# Altium project sensorboard.PrjPCB
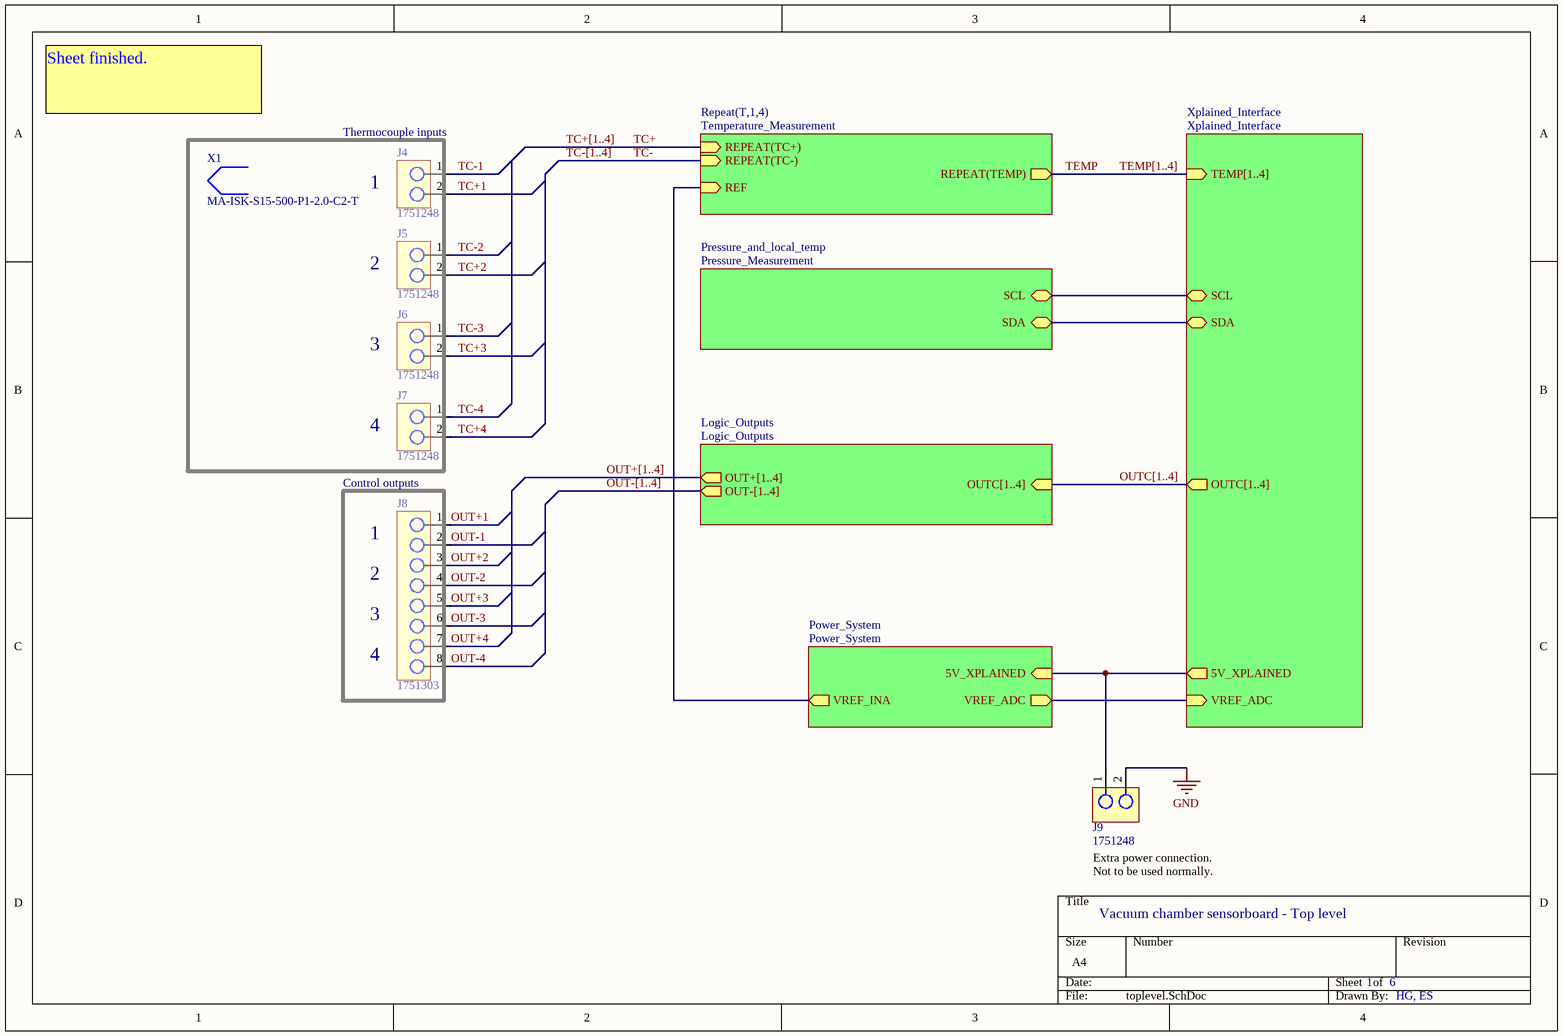
[diagram p0: toplevel.SchDoc]
ProjectTitle: Vacuum chamber sensorboard; Initials: HG, ES
6 sheets, 167 parts. Net scope: hierarchical (ports join the sheet entries above them; power ports are global).
Board file: Sensorboard.PcbDoc
Sheets:
  toplevel.SchDoc
    Xplained_Interface = Xplained_Interface.SchDoc
    Pressure_and_local_temp = Pressure_Measurement.SchDoc
    T1 = Temperature_Measurement.SchDoc
    T2 = Temperature_Measurement.SchDoc
    T3 = Temperature_Measurement.SchDoc
    T4 = Temperature_Measurement.SchDoc
    Logic_Outputs = Logic_Outputs.SchDoc
    Power_System = Power_System.SchDoc

## Sheet toplevel.SchDoc: Vacuum chamber sensorboard - Top level
size A4; SheetNumber: 1; SheetTotal: 6; PageSetup: Record=PageOptions|CenterHorizontal=True|CenterVertical=True|PrintScale=2.81|XCorrection=1.00|YCorrection=1.00|PrintKind=0|BorderSize=5000000|LeftOffset=0|BottomOffset=0|Orientation=2|PaperLength=1000|PaperWidth=1000|Scale=100|PaperSource=7|PrintQuality=-4|MediaType=1|DitherType=10|PaperKind=A1 (594 x 841mm)|PrintScaleMode=1

### Parts
J4  1751248  [Terminalblock Pheonix 2P]
J5  1751248  [Terminalblock Pheonix 2P]
J6  1751248  [Terminalblock Pheonix 2P]
J7  1751248  [Terminalblock Pheonix 2P]
J8  1751303  [TERMINALBLOCK pheonix 8p]
J9  1751248  [Terminalblock Pheonix 2P]
X1  MA-ISK-S15-500-P1-2.0-C2-T  (mechanical)

### Sub-sheets
Logic_Outputs = Logic_Outputs: OUT+[1..4] (out), OUTC[1..4] (in), OUT-[1..4] (out)
Power_System = Power_System: 5V_XPLAINED (in), VREF_ADC (out), VREF_INA (out)
Pressure_and_local_temp = Pressure_Measurement: SDA (bidir), SCL (bidir)
Repeat(T,1,4) = Temperature_Measurement: REPEAT(TC-) (in), REPEAT(TC+) (in), REPEAT(TEMP) (out), REF (in)
Xplained_Interface = Xplained_Interface: OUTC[1..4] (out), VREF_ADC (in), 5V_XPLAINED (out), SCL (bidir), SDA (bidir), TEMP[1..4] (in)

### Nets
GND: J9.2
OUT+1: J8.1
OUT+2: J8.3
OUT+3: J8.5
OUT+4: J8.7
OUT-1: J8.2
OUT-2: J8.4
OUT-3: J8.6
OUT-4: J8.8
SCL: sheet Xplained_Interface/SCL, sheet Pressure_and_local_temp/SCL
SDA: sheet Xplained_Interface/SDA, sheet Pressure_and_local_temp/SDA
TC+: sheet Repeat(T,1,4)/REPEAT(TC+)
TC+1: J4.2
TC+2: J5.2
TC+3: J6.2
TC+4: J7.2
TC-: sheet Repeat(T,1,4)/REPEAT(TC-)
TC-1: J4.1
TC-2: J5.1
TC-3: J6.1
TC-4: J7.1
TEMP: sheet Repeat(T,1,4)/REPEAT(TEMP)
NetC22_2: sheet Xplained_Interface/VREF_ADC, sheet Power_System/VREF_ADC
NetJ3_10: J9.1 ; sheet Xplained_Interface/5V_XPLAINED, sheet Power_System/5V_XPLAINED
NetTP9_0: sheet Repeat(T,1,4)/REF, sheet Power_System/VREF_INA

### Buses and harness runs
bus OUT+[1..4] = sheet Logic_Outputs/OUT+[1..4]
bus OUT-[1..4] = sheet Logic_Outputs/OUT-[1..4]
bus OUTC[1..4] = sheet Logic_Outputs/OUTC[1..4] = sheet Xplained_Interface/OUTC[1..4]
bus TC+[1..4]
bus TC-[1..4]
bus TEMP[1..4] = sheet Xplained_Interface/TEMP[1..4]

### Notes on the sheet
- Sheet finished.
- (near J4) Thermocouple inputs
- (near J4) 1
- (near J5) 2
- (near J6) 3
- (near J7) 4
- Control outputs
- (near J8) 1
- (near J8) 2
- (near J8) 3
- (near J8) 4
- Extra power connection.
  Not to be used normally.

### Library data of the parts
J4-J7 J9 = 1751248: Terminal block, 2P, 3.5mm, screw; Manufacturer: Phoenix Contact; ComponentLink1Description: Datasheet; ComponentLink1URL: https://www.phoenixcontact.com/online/portal/us?uri=pxc-oc-itemdetail:pid=1751248&library=usen&pcck=P-11-01-01&tab=1; PackageReference: SIP; Supplier 1: Mouser; Supplier Part Number 1: 651-1751248
J8 = 1751303: Terminal block, 8P, 3.5mm, screw; Manufacturer: Phoenix Contact; ComponentLink1Description: Datasheet; ComponentLink1URL: https://www.phoenixcontact.com/online/portal/us?uri=pxc-oc-itemdetail:pid=1751303&library=usen&pcck=P-11-01-01&tab=1; PackageReference: SIP; Supplier 1: Mouser; Supplier Part Number 1: 651-1751303
X1 = MA-ISK-S15-500-P1-2.0-C2-T: Type K thermocouple, mineral insulated; Manufacturer: Labfacility; PackageReference: http://www.farnell.com/datasheets/49105.pdf; ComponentLink1Description: Datasheet; ComponentLink1URL: http://www.ti.com/lit/ds/slvs720d/slvs720d.pdf; Supplier 1: Farnell; Supplier Part Number 1: 1289623

## Sheet Xplained_Interface.SchDoc: Vacuum chamber sensorboard - Xplained interface
size A4; SheetNumber: 6; SheetTotal: 6; PageSetup: Record=PageOptions|CenterHorizontal=True|CenterVertical=True|PrintScale=0.97|XCorrection=1.00|YCorrection=1.00|PrintKind=0|BorderSize=5000000|LeftOffset=0|BottomOffset=0|Orientation=2|PaperLength=1000|PaperWidth=1000|Scale=100|PaperSource=7|PrintQuality=-4|MediaType=1|DitherType=10|PaperKind=A4|PrintScaleMode=1
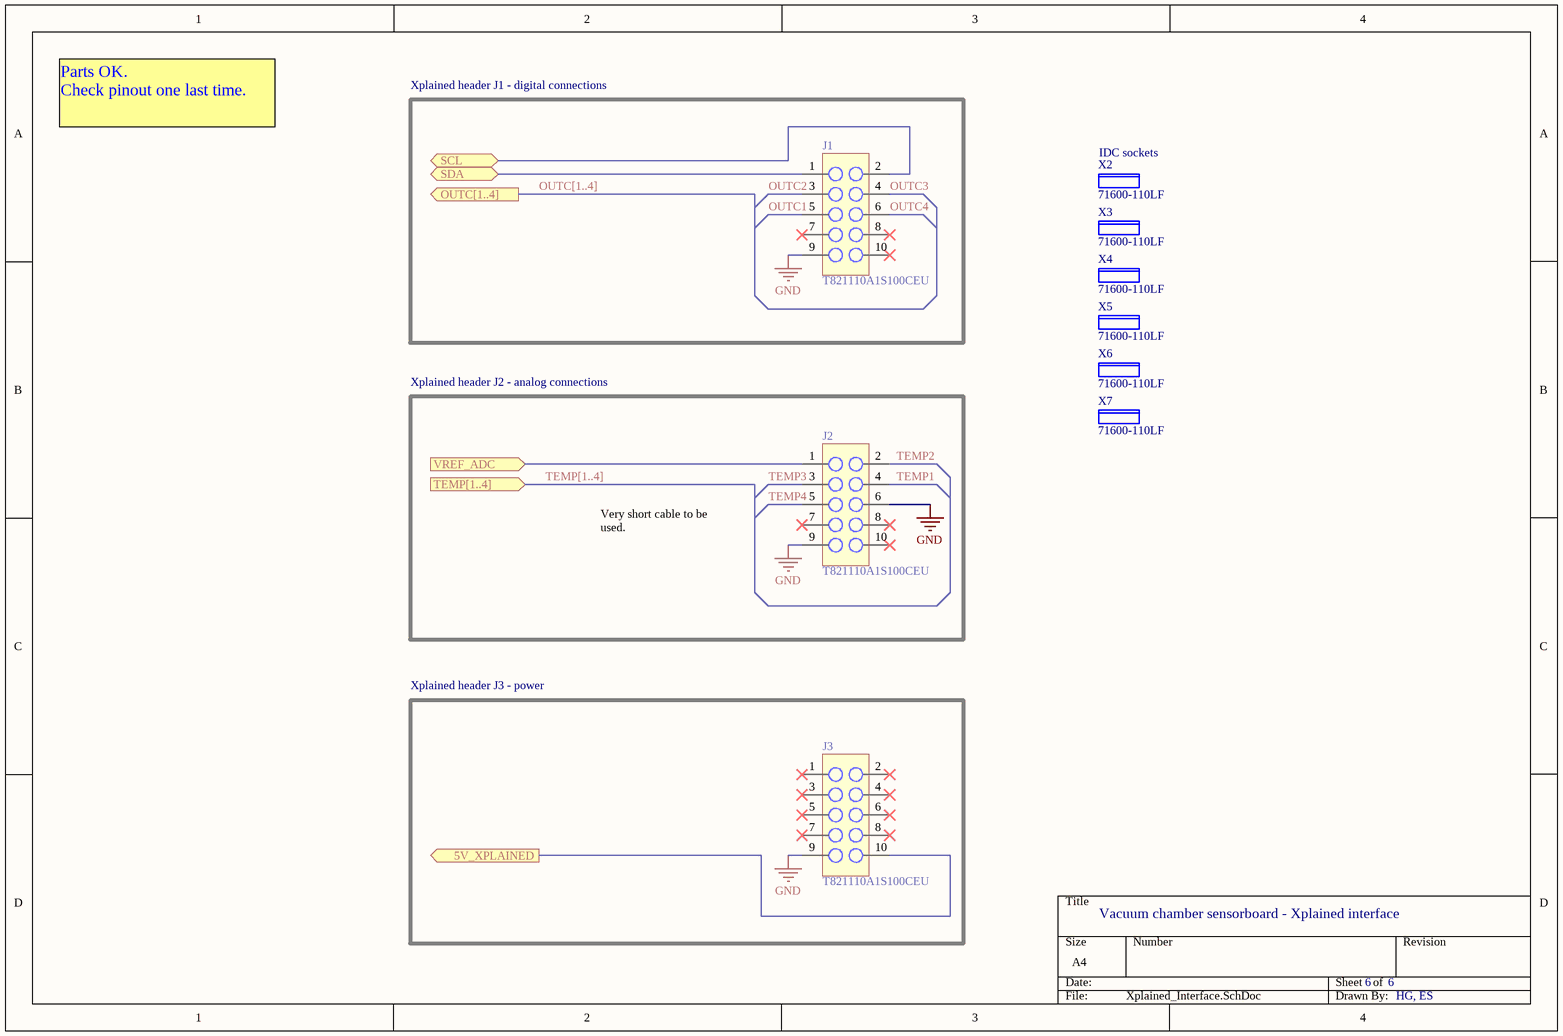
[diagram p1: Xplained_Interface.SchDoc]

### Parts
J1  T821110A1S100CEU  [Header 10P]
J2  T821110A1S100CEU  [Header 10P]
J3  T821110A1S100CEU  [Header 10P]
X2  71600-110LF  (mechanical)
X3  71600-110LF  (mechanical)
X4  71600-110LF  (mechanical)
X5  71600-110LF  (mechanical)
X6  71600-110LF  (mechanical)
X7  71600-110LF  (mechanical)

### Blocks framed on the sheet
Xplained header J1 - digital connections: J1
Xplained header J2 - analog connections: J2
Xplained header J3 - power: J3

### Ports
5V_XPLAINED (out), OUTC[1..4] (out), SCL (bidir), SDA (bidir), TEMP[1..4] (in), VREF_ADC (in)

### Nets
GND: J1.9 J2.6 J2.9 J3.9
OUTC1: J1.5
OUTC2: J1.3
OUTC3: J1.4
OUTC4: J1.6
SCL: J1.2 ; port SCL
SDA: J1.1 ; port SDA
TEMP1: J2.4
TEMP2: J2.2
TEMP3: J2.3
TEMP4: J2.5
NetC22_2: J2.1 ; port VREF_ADC
NetJ3_10: J3.10 ; port 5V_XPLAINED

Not connected (* = marked no-connect by the designer): J1 7* 8* 10*; J2 7* 8* 10*; J3 1* 2* 3* 4* 5* 6* 7* 8*

### Buses and harness runs
bus OUTC[1..4] = port OUTC[1..4]
bus TEMP[1..4] = port TEMP[1..4]

### Notes on the sheet
- Parts OK.
  Check pinout one last time.
- (near X2) IDC sockets
- Very short cable to be used.

### Library data of the parts
J1-J3 = T821110A1S100CEU: Header, 2x5, 2.54mm; Manufacturer: Amphenol; ComponentLink1Description: Datasheet; ComponentLink1URL: http://www.farnell.com/datasheets/1648843.pdf; PackageReference: DIP-10; Supplier 1: Farnell; Supplier Part Number 1: 2215304
X2-X7 = 71600-110LF: IDC socket, 10way, 2.54 mm; Manufacturer: FCI; ComponentLink1Description: Datasheet; ComponentLink1URL: http://www.farnell.com/datasheets/3453.pdf; Supplier 1: Farnell; Supplier Part Number 1: 1103927

## Sheet Pressure_Measurement.SchDoc: Vacuum chamber sensorboard - Pressure and local temperature
size A4; SheetNumber: 3; SheetTotal: 6
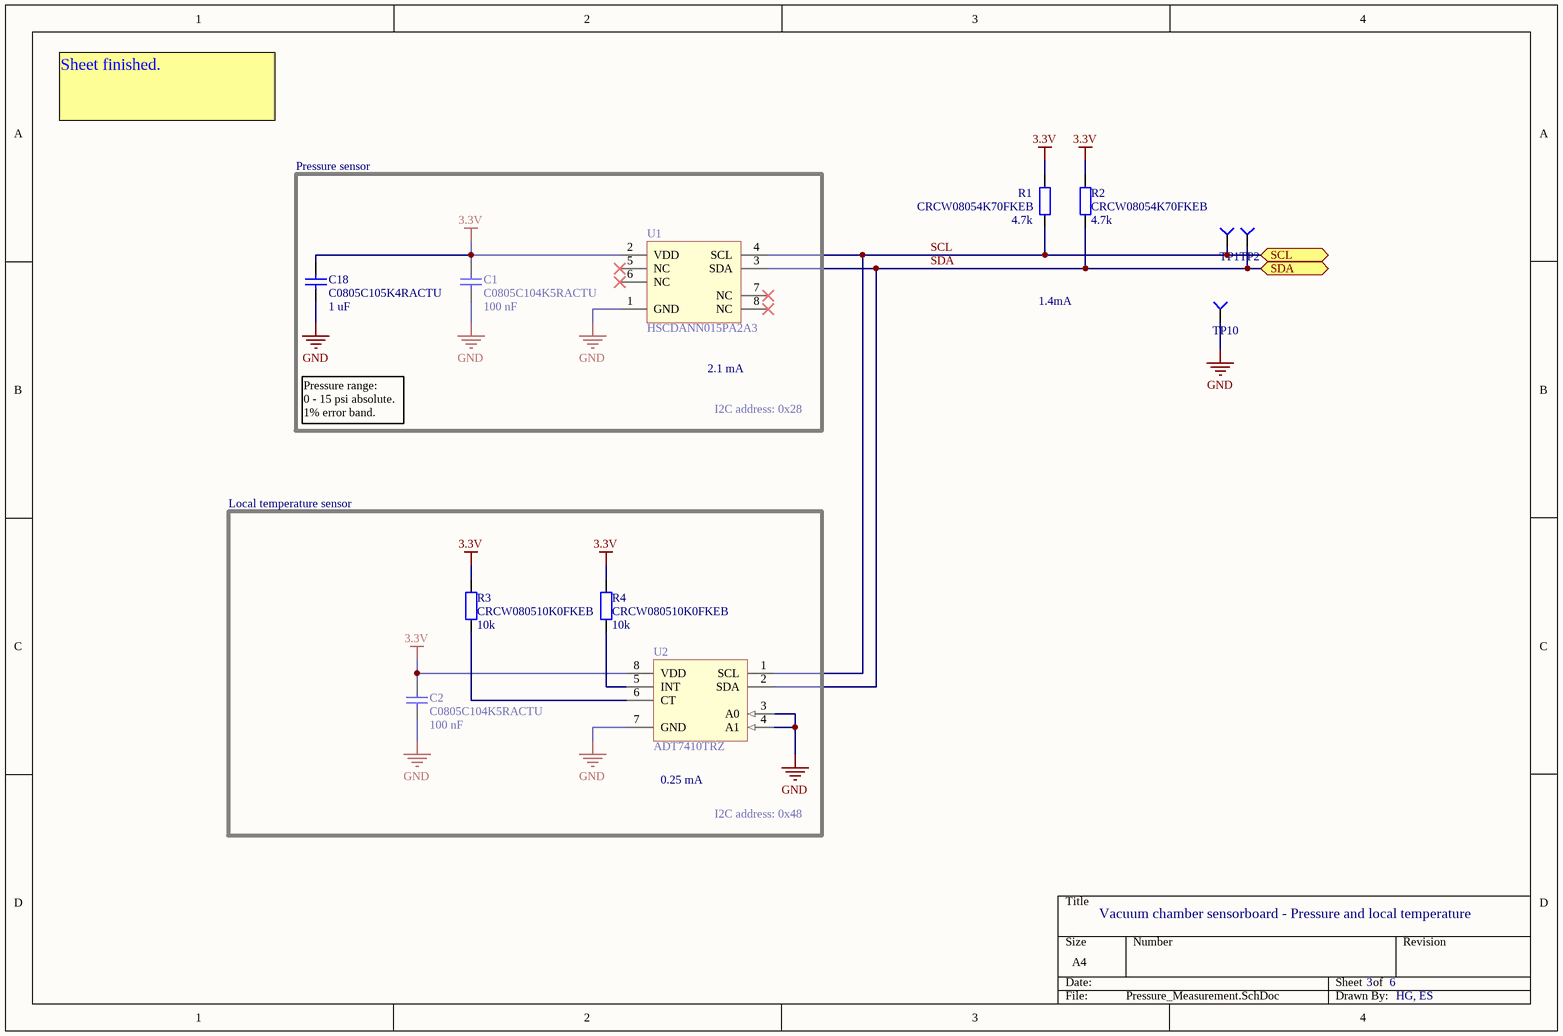
[diagram p2: Pressure_Measurement.SchDoc]

### Parts
C1  C0805C104K5RACTU  value 100 nF  [Cap Kemet 0805]
C2  C0805C104K5RACTU  value 100 nF  [Cap Kemet 0805]
C18  C0805C105K4RACTU  value 1 uF  [Cap Kemet 0805]
R1  CRCW08054K70FKEB  value 4.7k  [Res Vishay0805]
R2  CRCW08054K70FKEB  value 4.7k  [Res Vishay0805]
R3  CRCW080510K0FKEB  value 10k  [Res Vishay0805]
R4  CRCW080510K0FKEB  value 10k  [Res Vishay0805]
TP1  Test_point  [Testpoint]  (value not drawn)
TP2  Test_point  [Testpoint]  (value not drawn)
TP10  Test_point  [Testpoint]  (value not drawn)
U1  HSCDANN015PA2A3  [HSCDANN015PA2A3 Pressure sensor]
U2  ADT7410TRZ  [ADT7410]

### Ports
SCL (bidir), SDA (bidir)

### Nets
3.3V: C1.2 C2.2 C18.2 R1.2 R2.2 R3.2 R4.2 U1.2(VDD) U2.8(VDD)
GND: C1.1 C2.1 C18.1 TP10.0 U1.1(GND) U2.3(A0) U2.4(A1) U2.7(GND)
SCL: R1.1 TP1.0 U1.4(SCL) U2.1(SCL) ; port SCL
SDA: R2.1 TP2.0 U1.3(SDA) U2.2(SDA) ; port SDA
NetR3_1: R3.1 U2.6(CT)
NetR4_1: R4.1 U2.5(INT)

Not connected (* = marked no-connect by the designer): U1 5(NC)* 6(NC)* 7(NC)* 8(NC)*

### Notes on the sheet
- Sheet finished.
- Pressure sensor
- 1.4mA
- 2.1 mA
- Pressure range:
  0 - 15 psi absolute.
  1% error band.
- I2C address: 0x28
- Local temperature sensor
- (near U2) 0.25 mA
- I2C address: 0x48

### Library data of the parts
C1 C2 = C0805C104K5RACTU: Ceramic capacitor, X7R, 10%, 50V; Manufacturer: Kemet; ComponentLink1Description: Datasheet; ComponentLink1URL: http://www.kemet.com/kemet/web/homepage/kechome.nsf/vapubfiles/KEM_C1002_X7R_SMD.pdf/$file/KEM_C1002_X7R_SMD.pdf; PackageReference: 0805; Supplier 1: Mouser; Supplier Part Number 1: 80-C0805C104K5R; Supplier 2: Farnell; Supplier Part Number 2: 1414664
C18 = C0805C105K4RACTU: Ceramic capacitor, X7R, 10%, 16V; Manufacturer: Kemet; ComponentLink1Description: Datasheet; ComponentLink1URL: http://www.kemet.com/kemet/web/homepage/kechome.nsf/vapubfiles/KEM_C1002_X7R_SMD.pdf/$file/KEM_C1002_X7R_SMD.pdf; PackageReference: 0805; Supplier 1: Mouser; Supplier Part Number 1: 80-C0805C105K4R; Supplier 2: Farnell; Supplier Part Number 2: 9227792
R1 R2 = CRCW08054K70FKEB: Thick film resistor, 1%, 125mW; Manufacturer: Vishay; ComponentLink1Description: Datasheet; ComponentLink1URL: http://www.vishay.com/docs/20035/dcrcwe3.pdf; PackageReference: 0805; Supplier 1: Mouser; Supplier Part Number 1: 71-CRCW08054K70FKEB
R3 R4 = CRCW080510K0FKEB: Thick film resistor, 1%, 125mW; Manufacturer: Vishay; ComponentLink1Description: Datasheet; ComponentLink1URL: http://www.vishay.com/docs/20035/dcrcwe3.pdf; PackageReference: 0805; Supplier 1: Mouser; Supplier Part Number 1: 71-CRCW080510K0FKEB
TP1 TP2 TP10 = Test_point: pin to pad: 0>1; ComponentLink1Description: Datasheet
U1 = HSCDANN015PA2A3: Absolute pressure sensor, I2C output; PackageReference: DIP-8; ComponentLink1Description: Datasheet; ComponentLink1URL: http://sensing.honeywell.com/honeywell-sensing-hsc-high-accuracy-silicon-pressure-sensors-digital-product-sheet-008214-2-en.pdf?name=HSCMAND015PASA5; Supplier 1: Mouser; Supplier Part Number 1: 785-HSCDANN015PA2A3
U2 = ADT7410TRZ: Temperature sensor, I2C output; PackageReference: SOIC-8; ComponentLink1Description: Datasheet; ComponentLink1URL: http://www.analog.com/static/imported-files/data_sheets/ADT7410.pdf; Supplier 1: Mouser; Supplier Part Number 1: 584-ADT7410TRZ; Supplier 2: Farnell; Supplier Part Number 2: 2102534

## Sheet Temperature_Measurement.SchDoc: Vacuum chamber sensorboard - Thermocouple interface
size A4; SheetNumber: 2; SheetTotal: 6
Used 4 times, as channels T1, T2, T3, T4. Parts and nets are listed once, with the designators drawn on the sheet.
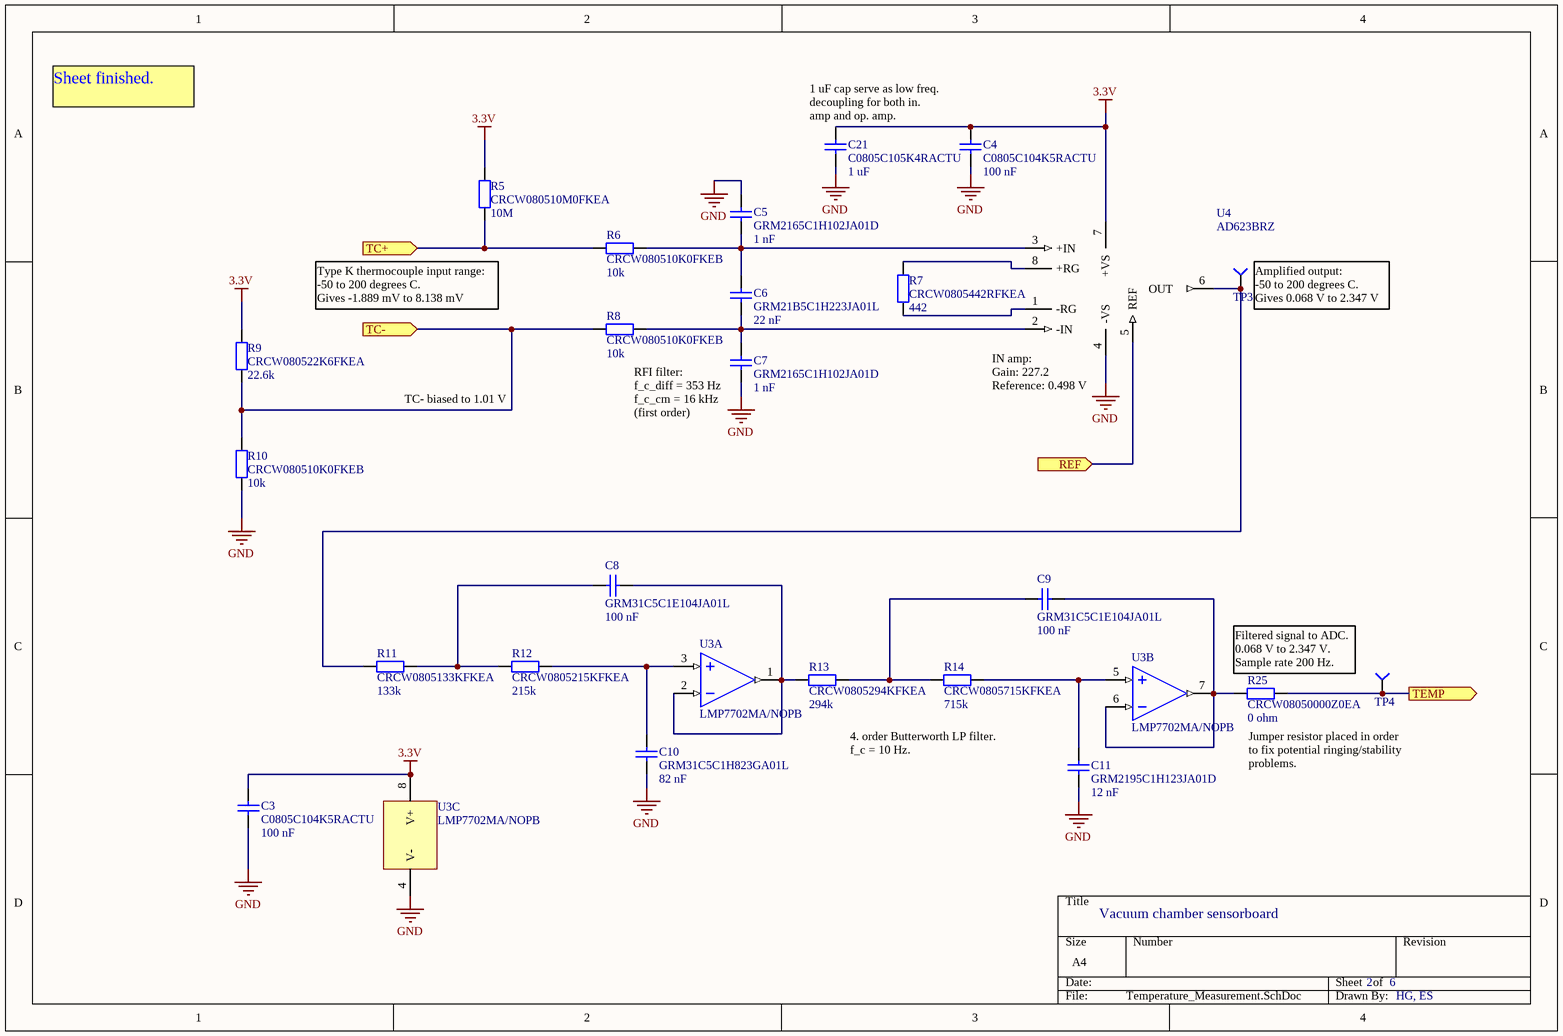
[diagram p3: Temperature_Measurement.SchDoc]

### Parts
C3  C0805C104K5RACTU  value 100 nF  [Cap Kemet 0805]
C4  C0805C104K5RACTU  value 100 nF  [Cap Kemet 0805]
C5  GRM2165C1H102JA01D  value 1 nF  [CAP0805 murata]
C6  GRM21B5C1H223JA01L  value 22 nF  [CAP0805 murata]
C7  GRM2165C1H102JA01D  value 1 nF  [CAP0805 murata]
C8  GRM31C5C1E104JA01L  value 100 nF  [Cap1206 Murata]
C9  GRM31C5C1E104JA01L  value 100 nF  [Cap1206 Murata]
C10  GRM31C5C1H823GA01L  value 82 nF  [Cap1206 Murata]
C11  GRM2195C1H123JA01D  value 12 nF  [CAP0805 murata]
C21  C0805C105K4RACTU  value 1 uF  [Cap Kemet 0805]
R5  CRCW080510M0FKEA  value 10M  [Res Vishay0805]
R6  CRCW080510K0FKEB  value 10k  [Res Vishay0805]
R7  CRCW0805442RFKEA  value 442  [Res Vishay0805]
R8  CRCW080510K0FKEB  value 10k  [Res Vishay0805]
R9  CRCW080522K6FKEA  value 22.6k  [Res Vishay0805]
R10  CRCW080510K0FKEB  value 10k  [Res Vishay0805]
R11  CRCW0805133KFKEA  value 133k  [Res Vishay0805]
R12  CRCW0805215KFKEA  value 215k  [Res Vishay0805]
R13  CRCW0805294KFKEA  value 294k  [Res Vishay0805]
R14  CRCW0805715KFKEA  value 715k  [Res Vishay0805]
R25  CRCW08050000Z0EA  value 0 ohm  [Res Vishay0805]
TP3  Test_point  [Testpoint]  (value not drawn)
TP4  Test_point  [Testpoint]  (value not drawn)
U3  LMP7702MA/NOPB  [OPA2333AIDR]  (parts A,B,C of 3)
U4  AD623BRZ  [AD623]

### Ports
REF (in), TC+ (in), TC- (in), TEMP (out)

### Nets
3.3V: C3.2 C4.2 C21.2 R5.2 R9.2 U3.8(V+) U4.7(+VS)
GND: C3.1 C4.1 C5.2 C7.1 C10.1 C11.1 C21.1 R10.1 U3.4(V-) U4.4(-VS)
REF: U4.5(REF) ; port REF
TC+: R5.1 R6.1 ; port TC+
TC-: R8.1 R9.1 R10.2 ; port TC-
TEMP: R25.2 TP4.0 ; port TEMP
NetC5_1: C5.1 C6.2 R6.2 U4.3(+IN)
NetC6_1: C6.1 C7.2 R8.2 U4.2(-IN)
NetC8_1: C8.1 R13.1 U3.1(OUT_A) U3.2(-IN_A)
NetC8_2: C8.2 R11.2 R12.1
NetC9_1: C9.1 R25.1 U3.6(-IN_B) U3.7(OUT_B)
NetC9_2: C9.2 R13.2 R14.1
NetC10_2: C10.2 R12.2 U3.3(+IN_A)
NetC11_2: C11.2 R14.2 U3.5(+IN_B)
NetR7_1: R7.1 U4.1(-RG)
NetR7_2: R7.2 U4.8(+RG)
NetR11_1: R11.1 TP3.0 U4.6(OUT)

### Channels
T1: designators end in _T1; ports REF=NetTP9_0 TC+=TC+1 TC-=TC-1 TEMP=TEMP1
T2: designators end in _T2; ports REF=NetTP9_0 TC+=TC+2 TC-=TC-2 TEMP=TEMP2
T3: designators end in _T3; ports REF=NetTP9_0 TC+=TC+3 TC-=TC-3 TEMP=TEMP3
T4: designators end in _T4; ports REF=NetTP9_0 TC+=TC+4 TC-=TC-4 TEMP=TEMP4

### Notes on the sheet
- Sheet finished.
- (near C21) 1 uF cap serve as low freq. decoupling for both in. amp and op. amp.
- Type K thermocouple input range:
  -50 to 200 degrees C.
  Gives -1.889 mV to 8.138 mV
- (near TP3) Amplified output:
  -50 to 200 degrees C.
  Gives 0.068 V to 2.347 V
- TC- biased to 1.01 V
- (near C7) RFI filter:
  f_c_diff = 353 Hz
  f_c_cm = 16 kHz
  (first order)
- (near U4) IN amp:
  Gain: 227.2
  Reference: 0.498 V
- Filtered signal to ADC.
  0.068 V to 2.347 V.
  Sample rate 200 Hz.
- 4. order Butterworth LP filter.
  f_c = 10 Hz.
- Jumper resistor placed in order to fix potential ringing/stability problems.

### Library data of the parts
C3 C4 = C0805C104K5RACTU: as C1 on sheet Pressure_Measurement; ComponentLink1Description: Datasheet; ComponentLink1URL: http://www.kemet.com/kemet/web/homepage/kechome.nsf/vapubfiles/KEM_C1002_X7R_SMD.pdf/$file/KEM_C1002_X7R_SMD.pdf; PackageReference: 0805; Supplier 1: Mouser; Supplier Part Number 1: 80-C0805C104K5R; Supplier 2: Farnell; Supplier Part Number 2: 1414664
C5 C7 = GRM2165C1H102JA01D: Ceramic capacitor, C0G, 5%, 50V; Manufacturer: Murata; ComponentLink1Description: Datasheet; ComponentLink1URL: http://psearch.murata.com/capacitor/product/GRM2165C1H102JA01%23.pdf; PackageReference: 0805; Supplier 1: Mouser; Supplier Part Number 1: 81-GRM40C102J50D
C6 = GRM21B5C1H223JA01L: Ceramic capacitor, C0G, 5%, 50V; Manufacturer: Murata; ComponentLink1Description: Datasheet; ComponentLink1URL: http://psearch.murata.com/capacitor/product/GRM21B5C1H223JA01%23.pdf; PackageReference: 0805; Supplier 1: Mouser; Supplier Part Number 1: 81-GRM215C1H223JA01L; Supplier 2: Farnell; Supplier Part Number 2: 1828943
C8 C9 = GRM31C5C1E104JA01L: Ceramic capacitor, C0G, 5%, 25V; Manufacturer: Murata; ComponentLink1Description: Datasheet; ComponentLink1URL: http://psearch.murata.com/capacitor/product/GRM31C5C1E104JA01%23.pdf; PackageReference: 1206; Supplier 1: Mouser; Supplier Part Number 1: 81-GRM31C5C1E104JA01
C10 = GRM31C5C1H823GA01L: Ceramic capacitor, C0G, 2%, 50V; Manufacturer: Murata; ComponentLink1Description: Datasheet; ComponentLink1URL: http://www.murata.com/products/catalog/pdf/c02e.pdf; PackageReference: 1206; Supplier 1: Mouser; Supplier Part Number 1: 81-GRM31C5C1H823GA1L
C11 = GRM2195C1H123JA01D: Ceramic capacitor, C0G, 5%, 50V; Manufacturer: Murata; ComponentLink1Description: Datasheet; ComponentLink1URL: http://psearch.murata.com/capacitor/product/GRM2195C1H123JA01%23.pdf; PackageReference: 0805; Supplier 1: Mouser; Supplier Part Number 1: 81-GRM2195C1H123JA1D
C21 = C0805C105K4RACTU: as C18 on sheet Pressure_Measurement; ComponentLink1Description: Datasheet; ComponentLink1URL: http://www.kemet.com/kemet/web/homepage/kechome.nsf/vapubfiles/KEM_C1002_X7R_SMD.pdf/$file/KEM_C1002_X7R_SMD.pdf; PackageReference: 0805; Supplier 1: Mouser; Supplier Part Number 1: 80-C0805C105K4R; Supplier 2: Farnell; Supplier Part Number 2: 9227792
R5 = CRCW080510M0FKEA: Thick film resistor, 1%, 125mW; Manufacturer: Vishay; ComponentLink1Description: Datasheet; ComponentLink1URL: http://www.vishay.com/docs/20035/dcrcwe3.pdf; PackageReference: 0805; Supplier 1: Mouser; Supplier Part Number 1: 71-CRCW0805-10M-E3
R6 R8 R10 = CRCW080510K0FKEB: as R3 on sheet Pressure_Measurement; ComponentLink1Description: Datasheet; ComponentLink1URL: http://www.vishay.com/docs/20035/dcrcwe3.pdf; PackageReference: 0805; Supplier 1: Mouser; Supplier Part Number 1: 71-CRCW080510K0FKEB
R7 = CRCW0805442RFKEA: Thick film resistor, 1%, 125mW; Manufacturer: Vishay; ComponentLink1Description: Datasheet; ComponentLink1URL: http://www.vishay.com/docs/20035/dcrcwe3.pdf; PackageReference: 0805; Supplier 1: Mouser; Supplier Part Number 1: 71-CRCW0805-442-E3
R9 = CRCW080522K6FKEA: Thick film resistor, 1%, 125mW; Manufacturer: Vishay; ComponentLink1Description: Datasheet; ComponentLink1URL: http://www.vishay.com/docs/20035/dcrcwe3.pdf; PackageReference: 0805; Supplier 1: Mouser; Supplier Part Number 1: 71-CRCW0805-22.6K-E3; Supplier 2: Farnell; Supplier Part Number 2: 1652961
R11 = CRCW0805133KFKEA: Thick film resistor, 1%, 125mW; Manufacturer: Vishay; ComponentLink1Description: Datasheet; ComponentLink1URL: http://www.vishay.com/docs/20035/dcrcwe3.pdf; PackageReference: 0805; Supplier 1: Mouser; Supplier Part Number 1: 71-CRCW0805-133K-E3
R12 = CRCW0805215KFKEA: Thick film resistor, 1%, 125mW; Manufacturer: Vishay; ComponentLink1Description: Datasheet; ComponentLink1URL: http://www.vishay.com/docs/20035/dcrcwe3.pdf; PackageReference: 0805; Supplier 1: Mouser; Supplier Part Number 1: 71-CRCW0805-215K-E3; Supplier 2: Farnell; Supplier Part Number 2: 1652955
R13 = CRCW0805294KFKEA: Thick film resistor, 1%, 125mW; Manufacturer: Vishay; ComponentLink1Description: Datasheet; ComponentLink1URL: http://www.vishay.com/docs/20035/dcrcwe3.pdf; PackageReference: 0805; Supplier 1: Mouser; Supplier Part Number 1: 71-CRCW0805294KFKEA
R14 = CRCW0805715KFKEA: Thick film resistor, 1%, 125mW; Manufacturer: Vishay; ComponentLink1Description: Datasheet; ComponentLink1URL: http://www.vishay.com/docs/20035/dcrcwe3.pdf; PackageReference: 0805; Supplier 1: Mouser; Supplier Part Number 1: 71-CRCW0805715KFKEA
R25 = CRCW08050000Z0EA: Thick film resistor, 1%, 125mW; Manufacturer: Vishay; ComponentLink1Description: Datasheet; ComponentLink1URL: http://www.vishay.com/docs/20035/dcrcwe3.pdf; PackageReference: 0805; Supplier 1: Mouser; Supplier Part Number 1: 71-CRCW0805-0-E3
TP3 TP4 = Test_point: pin to pad: 0>1; ComponentLink1Description: Datasheet
U3 = LMP7702MA/NOPB: Op. amp, dual, rail-to-rail, single supply; PackageReference: SOIC-8; ComponentLink1Description: Datasheet; ComponentLink1URL: http://www.ti.com/lit/ds/symlink/lmp7702.pdf; Supplier 1: Farnell; Supplier Part Number 1: 1651867
U4 = AD623BRZ: Instrumentation amplifier, rail to rail; ComponentLink1Description: Datasheet; ComponentLink1URL: http://www.analog.com/static/imported-files/data_sheets/AD623.pdf; Supplier 1: Mouser; Supplier Part Number 1: 584-AD623BRZ; PackageReference: SOIC-8; Supplier 2: Farnell; Supplier Part Number 2: 2305589

## Sheet Logic_Outputs.SchDoc: Vacuum chamber sensorboard - Control outputs
size A4; SheetNumber: 4; SheetTotal: 6
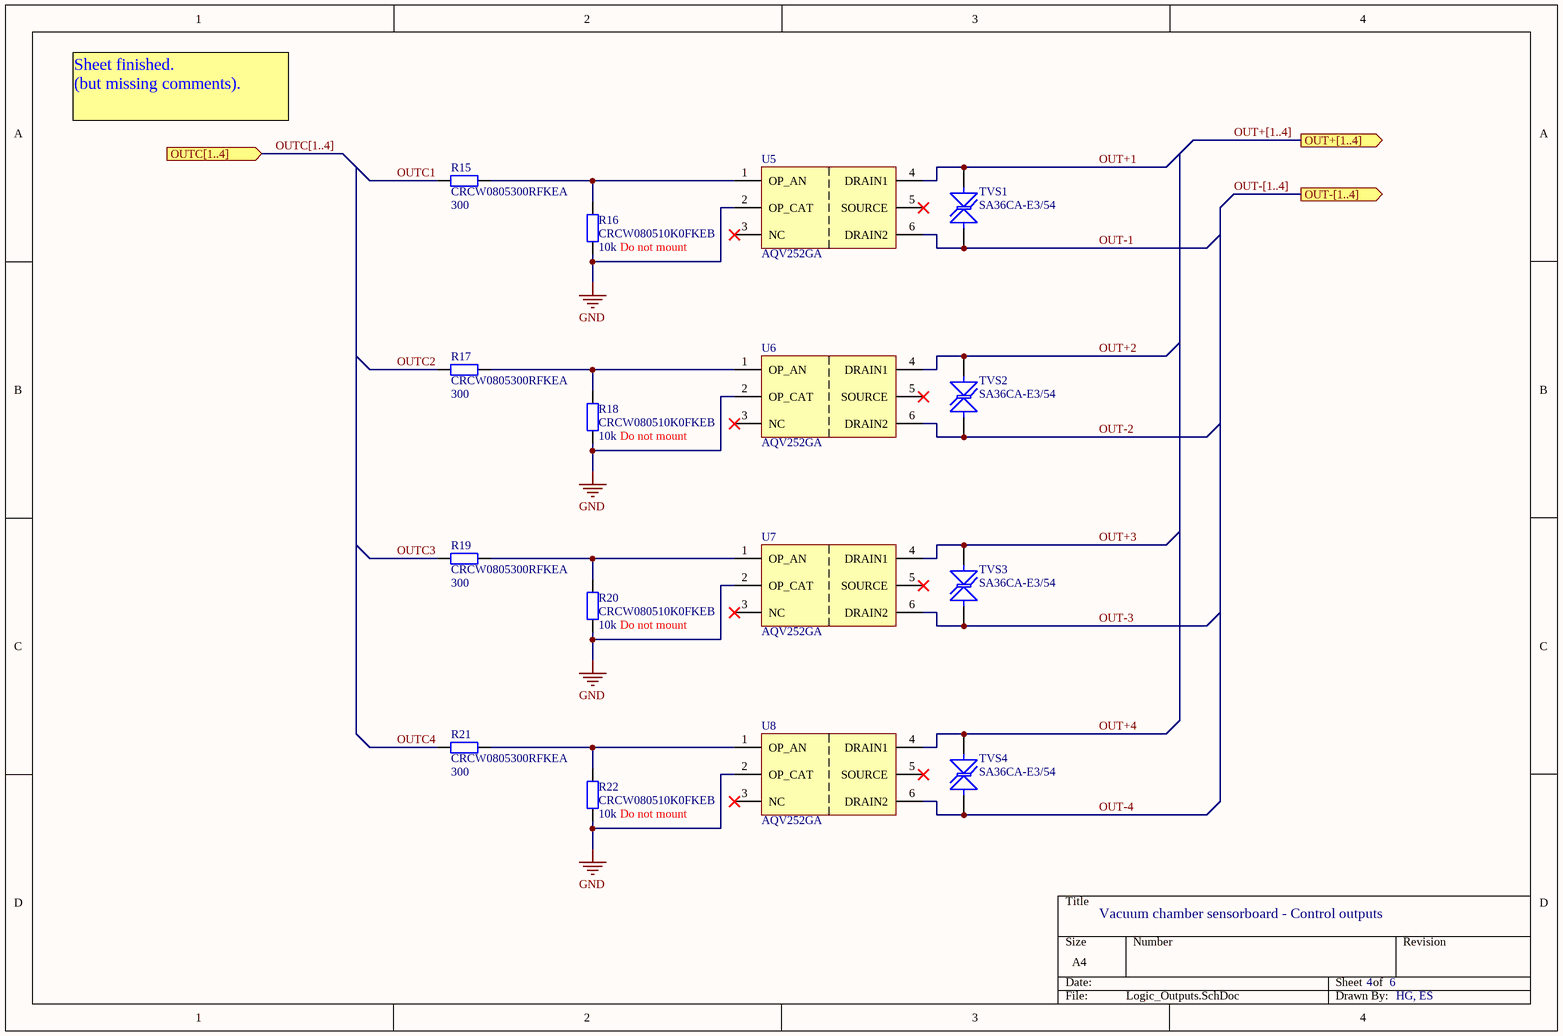
[diagram p4: Logic_Outputs.SchDoc]

### Parts
R15  CRCW0805300RFKEA  value 300  [Res Vishay0805]
R16  CRCW080510K0FKEB  value 10k  [Res Vishay0805]
R17  CRCW0805300RFKEA  value 300  [Res Vishay0805]
R18  CRCW080510K0FKEB  value 10k  [Res Vishay0805]
R19  CRCW0805300RFKEA  value 300  [Res Vishay0805]
R20  CRCW080510K0FKEB  value 10k  [Res Vishay0805]
R21  CRCW0805300RFKEA  value 300  [Res Vishay0805]
R22  CRCW080510K0FKEB  value 10k  [Res Vishay0805]
TVS1  SA36CA-E3/54  [Diode Vishay]
TVS2  SA36CA-E3/54  [Diode Vishay]
TVS3  SA36CA-E3/54  [Diode Vishay]
TVS4  SA36CA-E3/54  [Diode Vishay]
U5  AQV252GA  [AQV252GA Panasonic]
U6  AQV252GA  [AQV252GA Panasonic]
U7  AQV252GA  [AQV252GA Panasonic]
U8  AQV252GA  [AQV252GA Panasonic]

### Ports
OUT+[1..4] (out), OUT-[1..4] (out), OUTC[1..4] (in)

### Nets
GND: R16.1 R18.1 R20.1 R22.1 U5.2(OP_CAT) U6.2(OP_CAT) U7.2(OP_CAT) U8.2(OP_CAT)
OUT+1: TVS1.2(K) U5.4(DRAIN1)
OUT+2: TVS2.2(K) U6.4(DRAIN1)
OUT+3: TVS3.2(K) U7.4(DRAIN1)
OUT+4: TVS4.2(K) U8.4(DRAIN1)
OUT-1: TVS1.1(A) U5.6(DRAIN2)
OUT-2: TVS2.1(A) U6.6(DRAIN2)
OUT-3: TVS3.1(A) U7.6(DRAIN2)
OUT-4: TVS4.1(A) U8.6(DRAIN2)
OUTC1: R15.1
OUTC2: R17.1
OUTC3: R19.1
OUTC4: R21.1
NetR15_2: R15.2 R16.2 U5.1(OP_AN)
NetR17_2: R17.2 R18.2 U6.1(OP_AN)
NetR19_2: R19.2 R20.2 U7.1(OP_AN)
NetR21_2: R21.2 R22.2 U8.1(OP_AN)

Not connected (* = marked no-connect by the designer): U5 3(NC)* 5(SOURCE)*; U6 3(NC)* 5(SOURCE)*; U7 3(NC)* 5(SOURCE)*; U8 3(NC)* 5(SOURCE)*

### Buses and harness runs
bus OUT+[1..4] = port OUT+[1..4]
bus OUT-[1..4] = port OUT-[1..4]
bus OUTC[1..4] = port OUTC[1..4]

### Notes on the sheet
- Sheet finished.
  (but missing comments).
- (near R16) Do not mount
- (near R18) Do not mount
- (near R20) Do not mount
- (near R22) Do not mount

### Library data of the parts
R15 R17 R19 R21 = CRCW0805300RFKEA: Thick film resistor, 1%, 125mW; Manufacturer: Vishay; ComponentLink1Description: Datasheet; ComponentLink1URL: http://www.vishay.com/docs/20035/dcrcwe3.pdf; PackageReference: 0805; Supplier 1: Mouser; Supplier Part Number 1: 71-CRCW0805300RFKEA
R16 R18 R20 R22 = CRCW080510K0FKEB: as R3 on sheet Pressure_Measurement; ComponentLink1Description: Datasheet; ComponentLink1URL: http://www.vishay.com/docs/20035/dcrcwe3.pdf; PackageReference: 0805; Supplier 1: Mouser; Supplier Part Number 1: 71-CRCW080510K0FKEB
TVS1-TVS4 = SA36CA-E3/54: TVS diode, bidirectional, 36 V; pin to pad: 1>A 2>K; Manufacturer: Vishay; ComponentLink1Description: Datasheet; ComponentLink1URL: http://www.vishay.com/docs/88378/sa50athrusa170ca.pdf; PackageReference: DO-204AC; Supplier 1: Mouser; Supplier Part Number 1: 625-SA36CA-E3/54
U5-U8 = AQV252GA: Solid state relay, DC/AC, 60V, 2.5A; Manufacturer: Panasonic; PackageReference: SMD-6; ComponentLink1Description: Datasheet; ComponentLink1URL: http://www3.panasonic.biz/ac/e/control/relay/photomos/he/he1a_aqv25_g/index.jsp; Supplier 1: Mouser; Supplier Part Number 1: 769-AQV252GA

## Sheet Power_System.SchDoc: Vacuum chamber sensorboard - Power and reference
size A4; SheetNumber: 5; SheetTotal: 6
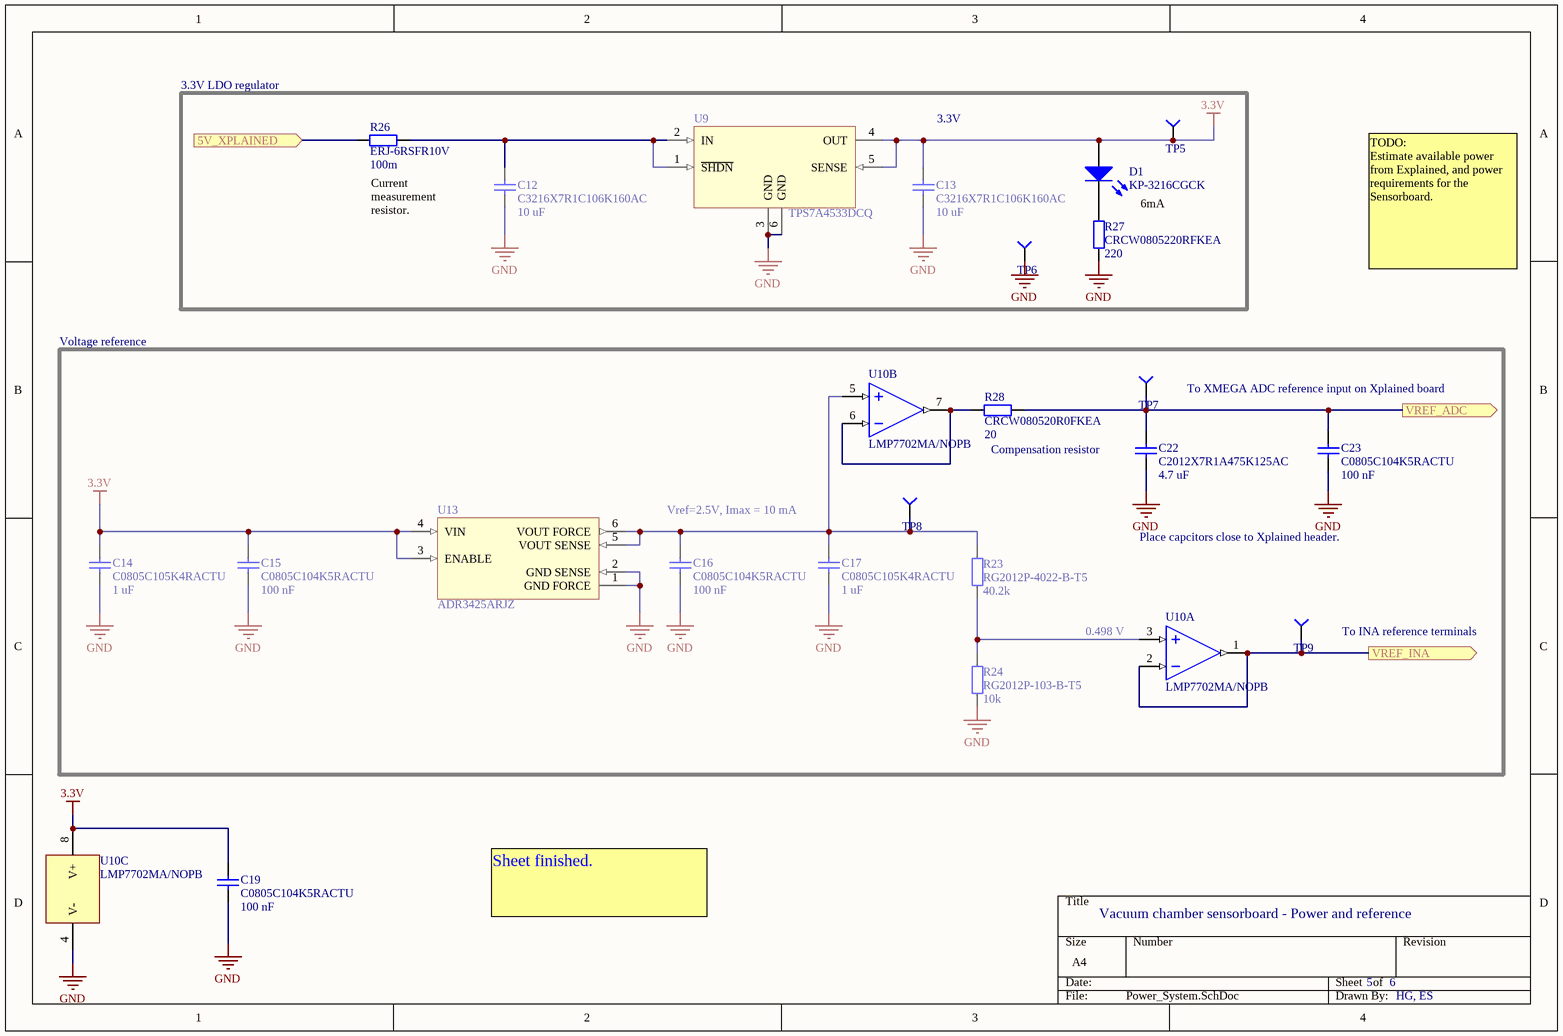
[diagram p5: Power_System.SchDoc]

### Parts
C12  C3216X7R1C106K160AC  value 10 uF  [Cap TDK1206]
C13  C3216X7R1C106K160AC  value 10 uF  [Cap TDK1206]
C14  C0805C105K4RACTU  value 1 uF  [Cap Kemet 0805]
C15  C0805C104K5RACTU  value 100 nF  [Cap Kemet 0805]
C16  C0805C104K5RACTU  value 100 nF  [Cap Kemet 0805]
C17  C0805C105K4RACTU  value 1 uF  [Cap Kemet 0805]
C19  C0805C104K5RACTU  value 100 nF  [Cap Kemet 0805]
C22  C2012X7R1A475K125AC  value 4.7 uF  [Cap TDK0805]
C23  C0805C104K5RACTU  value 100 nF  [Cap Kemet 0805]
D1  KP-3216CGCK  [Diode Kingbright]
R23  RG2012P-4022-B-T5  value 40.2k  [RES SSM 0805]
R24  RG2012P-103-B-T5  value 10k  [RES SSM 0805]
R26  ERJ-6RSFR10V  value 100m  [Res panasonic0805]
R27  CRCW0805220RFKEA  value 220  [Res Vishay0805]
R28  CRCW080520R0FKEA  value 20  [Res Vishay0805]
TP5  Test_point  [Testpoint]  (value not drawn)
TP6  Test_point  [Testpoint]  (value not drawn)
TP7  Test_point  [Testpoint]  (value not drawn)
TP8  Test_point  [Testpoint]  (value not drawn)
TP9  Test_point  [Testpoint]  (value not drawn)
U9  TPS7A4533DCQ  [TPS7A4533DCQ]
U10  LMP7702MA/NOPB  [OPA2333AIDR]  (parts A,B,C of 3)
U13  ADR3425ARJZ  [ADR3425]

### Ports
5V_XPLAINED (in), VREF_ADC (out), VREF_INA (out)

### Nets
3.3V: C13.2 C14.2 C15.2 C19.2 D1.1(A) TP5.0 U9.4(OUT) U9.5(SENSE) U10.8(V+) U13.3(ENABLE) U13.4(VIN)
GND: C12.1 C13.1 C14.1 C15.1 C16.1 C17.1 C19.1 C22.1 C23.1 R24.1 R27.1 TP6.0 U9.3(GND) U9.6(GND) U10.4(V-) U13.1(GND_FORCE) U13.2(GND_SENSE)
NetC12_2: C12.2 R26.2 U9.1(~{SHDN}) U9.2(IN)
NetC16_2: C16.2 C17.2 R23.2 TP8.0 U10.5(+IN_B) U13.5(VOUT_SENSE) U13.6(VOUT_FORCE)
NetC22_2: C22.2 C23.2 R28.2 TP7.0 ; port VREF_ADC
NetD1_2: D1.2(K) R27.2
NetJ3_10: R26.1 ; port 5V_XPLAINED
NetR23_1: R23.1 R24.2 U10.3(+IN_A)
NetR28_1: R28.1 U10.6(-IN_B) U10.7(OUT_B)
NetTP9_0: TP9.0 U10.1(OUT_A) U10.2(-IN_A) ; port VREF_INA

### Notes on the sheet
- 3.3V LDO regulator
- 3.3V
- (near R26) Current measurement resistor.
- 6mA
- TODO:
  Estimate available power from Explained, and power requirements for the Sensorboard.
- Voltage reference
- To XMEGA ADC reference input on Xplained board
- Vref=2.5V, Imax = 10 mA
- Compensation resistor
- Place capcitors close to Xplained header.
- (near U10) 0.498 V
- (near TP9) To INA reference terminals
- Sheet finished.

### Library data of the parts
C12 C13 = C3216X7R1C106K160AC: Ceramic capacitor, X7R, 10%, 16V; Manufacturer: TDK; ComponentLink1Description: Datasheet; ComponentLink1URL: http://www.mouser.com/ds/2/400/C3216X7R1C106K160AC-265314.pdf; PackageReference: 1206; Supplier 1: Mouser; Supplier Part Number 1: 810-C3216X7R1C106K; Supplier 2: Farnell; Supplier Part Number 2: 1907353
C14 C17 = C0805C105K4RACTU: as C18 on sheet Pressure_Measurement; ComponentLink1Description: Datasheet; ComponentLink1URL: http://www.kemet.com/kemet/web/homepage/kechome.nsf/vapubfiles/KEM_C1002_X7R_SMD.pdf/$file/KEM_C1002_X7R_SMD.pdf; PackageReference: 0805; Supplier 1: Mouser; Supplier Part Number 1: 80-C0805C105K4R; Supplier 2: Farnell; Supplier Part Number 2: 9227792
C15 C16 C19 C23 = C0805C104K5RACTU: as C1 on sheet Pressure_Measurement; ComponentLink1Description: Datasheet; ComponentLink1URL: http://www.kemet.com/kemet/web/homepage/kechome.nsf/vapubfiles/KEM_C1002_X7R_SMD.pdf/$file/KEM_C1002_X7R_SMD.pdf; PackageReference: 0805; Supplier 1: Mouser; Supplier Part Number 1: 80-C0805C104K5R; Supplier 2: Farnell; Supplier Part Number 2: 1414664
C22 = C2012X7R1A475K125AC: Ceramic capacitor, X7R, 10%, 10V; Manufacturer: TDK; ComponentLink1Description: Datasheet; ComponentLink1URL: http://product.tdk.com/capacitor/mlcc/en/documents/C2012X7R1A475K125AC.pdf; PackageReference: 0805; Supplier 1: Mouser; Supplier Part Number 1: 810-C2012X7R1A475K
D1 = KP-3216CGCK: Chip led lamp,green, 50mcd @ 20mA; pin to pad: 1>A 2>K; Manufacturer: Kingbright; ComponentLink1Description: Datasheet; ComponentLink1URL: http://www.farnell.com/datasheets/1683499.pdf; PackageReference: 3.2x1.6mm; Supplier 1: Farnell; Supplier Part Number 1: 2290333
R23 = RG2012P-4022-B-T5: Thin film resistor, 0.1%, 100mW; Manufacturer: Susumu; ComponentLink1Description: Datasheet; ComponentLink1URL: http://susumu-usa.com/pdf/RG_RM_RGH_DATASHEET.pdf; PackageReference: 0805; Supplier 1: Mouser; Supplier Part Number 1: 754-RG2012P-4022-BT5
R24 = RG2012P-103-B-T5: Thin film resistor, 0.1%, 100mW; Manufacturer: Susumu; ComponentLink1Description: Datasheet; ComponentLink1URL: http://susumu-usa.com/pdf/RG_RM_RGH_DATASHEET.pdf; PackageReference: 0805; Supplier 1: Mouser; Supplier Part Number 1: 754-RG2012P-103-B-T5
R26 = ERJ-6RSFR10V: Thick film resistor, 1%, 125mW; Manufacturer: Panasonic; ComponentLink1Description: Datasheet; ComponentLink1URL: http://industrial.panasonic.com/www-data/pdf/AOA0000/AOA0000CE3.pdf; PackageReference: 0805; Supplier 1: Mouser; Supplier Part Number 1: 667-ERJ-6RSFR10V; Supplier 2: Farnell; Supplier Part Number 2: 1717785
R27 = CRCW0805220RFKEA: Thick film resistor, 1%, 125mW; Manufacturer: Vishay; ComponentLink1Description: Datasheet; ComponentLink1URL: http://www.vishay.com/docs/20035/dcrcwe3.pdf; PackageReference: 0805; Supplier 1: Mouser; Supplier Part Number 1: 71-CRCW0805-220-E3
R28 = CRCW080520R0FKEA: Thick film resistor, 1%, 125mW; Manufacturer: Vishay; ComponentLink1Description: Datasheet; ComponentLink1URL: http://www.vishay.com/docs/20035/dcrcwe3.pdf; PackageReference: 0805; Supplier 1: Mouser; Supplier Part Number 1: 71-CRCW0805-20-E3
TP5-TP9 = Test_point: pin to pad: 0>1; ComponentLink1Description: Datasheet
U9 = TPS7A4533DCQ: LDO regulator, 3.3V, 1.5A; Manufacturer: Texas Instruments; PackageReference: SOT-223-6; ComponentLink1Description: Datasheet; ComponentLink1URL: http://www.ti.com/lit/ds/slvs720d/slvs720d.pdf; Supplier 1: Mouser; Supplier Part Number 1: 595-TPS7A4533DCQT
U10 = LMP7702MA/NOPB: as U3 on sheet Temperature_Measurement; PackageReference: SOIC-8; ComponentLink1Description: Datasheet; ComponentLink1URL: http://www.ti.com/lit/ds/symlink/lmp7702.pdf; Supplier 1: Farnell; Supplier Part Number 1: 1651867
U13 = ADR3425ARJZ: Series voltage reference, 2.5V; Manufacturer: Analog Devices; PackageReference: SOT-23-6; ComponentLink1Description: Datasheet; ComponentLink1URL: http://www.analog.com/static/imported-files/data_sheets/ADR3412_ADR3420_ADR3425_ADR3430_ADR3433_ADR3440_ADR3450.pdf; Supplier 1: Mouser; Supplier Part Number 1: 584-ADR3425ARJZ-R7; Supplier 2: Farnell; Supplier Part Number 2: 1827384

## Nets that join several sheets
3.3V: Pressure_Measurement (9 pins), T1 (7 pins), T2 (7 pins), T3 (7 pins), T4 (7 pins), Power_System (11 pins)
GND: toplevel (J9.2), Xplained_Interface (J1.9 J2.6 J2.9 J3.9), Pressure_Measurement (8 pins), T1 (10 pins), T2 (10 pins), T3 (10 pins), T4 (10 pins), Logic_Outputs (8 pins), Power_System (17 pins)
NetC22_2: Xplained_Interface (J2.1), Power_System (C22.2 C23.2 R28.2 TP7.0)
NetJ3_10: toplevel (J9.1), Xplained_Interface (J3.10), Power_System (R26.1)
NetTP9_0: T1 (U4_T1.5), T2 (U4_T2.5), T3 (U4_T3.5), T4 (U4_T4.5), Power_System (TP9.0 U10.1 U10.2)
OUT+1: toplevel (J8.1), Logic_Outputs (TVS1.2 U5.4)
OUT+2: toplevel (J8.3), Logic_Outputs (TVS2.2 U6.4)
OUT+3: toplevel (J8.5), Logic_Outputs (TVS3.2 U7.4)
OUT+4: toplevel (J8.7), Logic_Outputs (TVS4.2 U8.4)
OUT-1: toplevel (J8.2), Logic_Outputs (TVS1.1 U5.6)
OUT-2: toplevel (J8.4), Logic_Outputs (TVS2.1 U6.6)
OUT-3: toplevel (J8.6), Logic_Outputs (TVS3.1 U7.6)
OUT-4: toplevel (J8.8), Logic_Outputs (TVS4.1 U8.6)
OUTC1: Xplained_Interface (J1.5), Logic_Outputs (R15.1)
OUTC2: Xplained_Interface (J1.3), Logic_Outputs (R17.1)
OUTC3: Xplained_Interface (J1.4), Logic_Outputs (R19.1)
OUTC4: Xplained_Interface (J1.6), Logic_Outputs (R21.1)
SCL: Xplained_Interface (J1.2), Pressure_Measurement (R1.1 TP1.0 U1.4 U2.1)
SDA: Xplained_Interface (J1.1), Pressure_Measurement (R2.1 TP2.0 U1.3 U2.2)
TC+1: toplevel (J4.2), T1 (R5_T1.1 R6_T1.1)
TC+2: toplevel (J5.2), T2 (R5_T2.1 R6_T2.1)
TC+3: toplevel (J6.2), T3 (R5_T3.1 R6_T3.1)
TC+4: toplevel (J7.2), T4 (R5_T4.1 R6_T4.1)
TC-1: toplevel (J4.1), T1 (R8_T1.1 R9_T1.1 R10_T1.2)
TC-2: toplevel (J5.1), T2 (R8_T2.1 R9_T2.1 R10_T2.2)
TC-3: toplevel (J6.1), T3 (R8_T3.1 R9_T3.1 R10_T3.2)
TC-4: toplevel (J7.1), T4 (R8_T4.1 R9_T4.1 R10_T4.2)
TEMP1: Xplained_Interface (J2.4), T1 (R25_T1.2 TP4_T1.0)
TEMP2: Xplained_Interface (J2.2), T2 (R25_T2.2 TP4_T2.0)
TEMP3: Xplained_Interface (J2.3), T3 (R25_T3.2 TP4_T3.0)
TEMP4: Xplained_Interface (J2.5), T4 (R25_T4.2 TP4_T4.0)